# Altium schematic sheet 04_POWER_USB.SchDoc
size A3; DocumentNumber: 4; SheetNumber: 4; SheetTotal: 5; PageSetup: Record=PageOptions|CenterHorizontal=True|CenterVertical=True|PrintScale=1.00|XCorrection=1.00|YCorrection=1.00|PrintKind=1|BorderSize=5000000|LeftOffset=0|BottomOffset=0|Orientation=2|PaperLength=1000|PaperWidth=1000|Scale=100|PaperSource=7|PrintQuality=-4|MediaType=1|DitherType=10|PrintScaleMode=0|PaperKind=Letter|PaperIndex=1
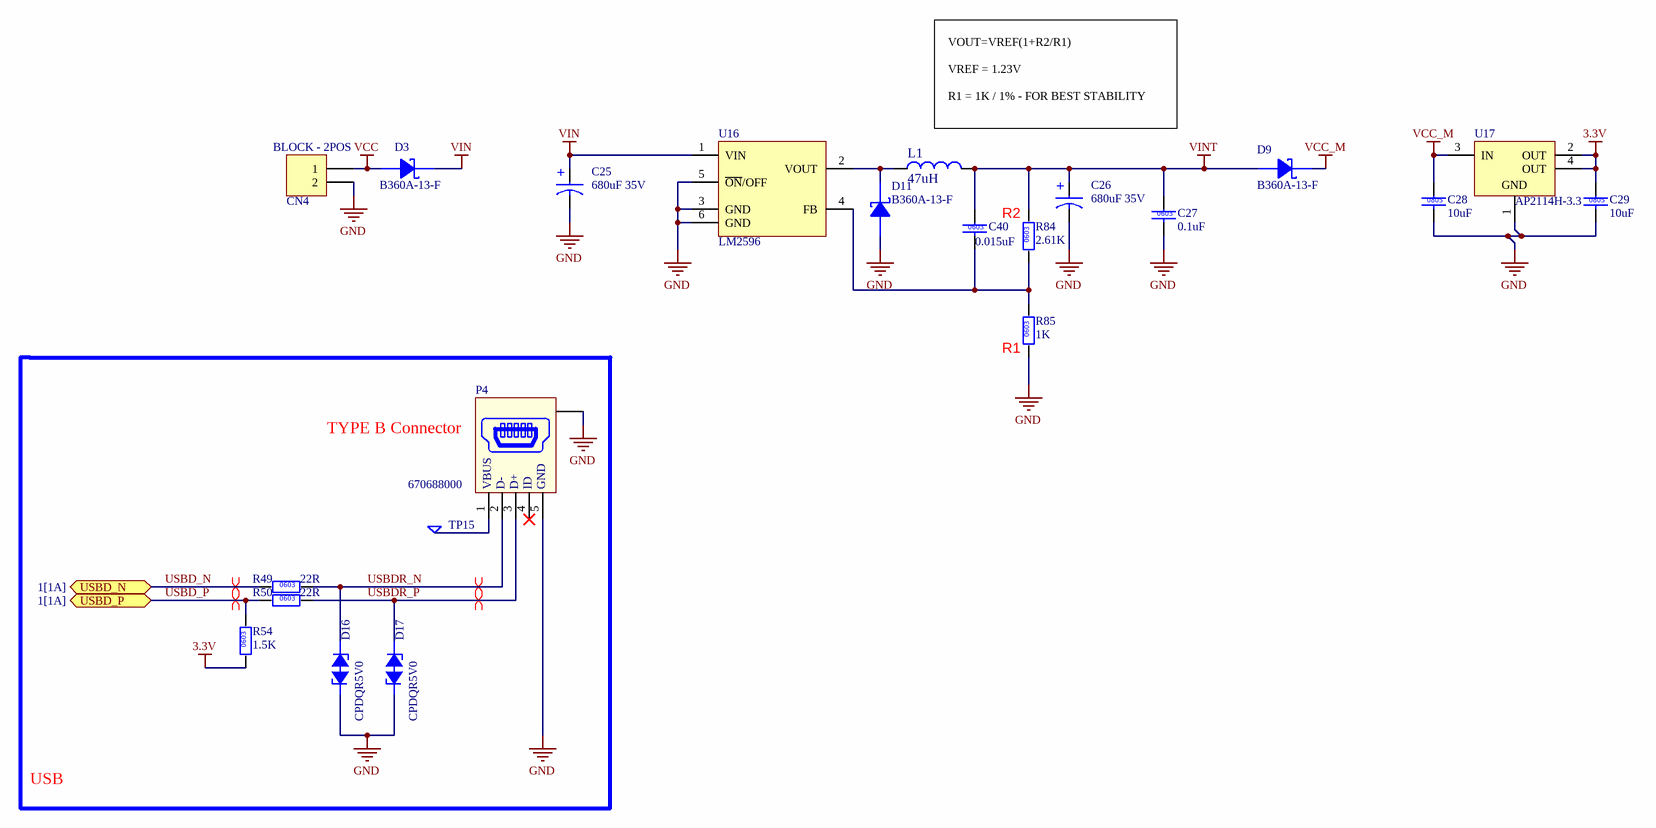
[diagram p0: 04_POWER_USB.SchDoc]

## Parts
?  (no value)  (graphical)
C25  680uF 35V  [CAP_RADIAL_10X28]
C26  680uF 35V  [CAP_RADIAL_10X28]
C27  0.1uF  [0603C]
C28  10uF  [0805C]
C29  10uF  [0805C]
C40  0.015uF  [0603C]
CN4  BLOCK - 2POS  [CONN_BORNE_3.81_2POS]
D3  B360A-13-F  [DO-214AC]
D9  B360A-13-F  [DO-214AC]
D11  B360A-13-F  [DO-214AC]
D16  CPDQR5V0  [0402ESD]
D17  CPDQR5V0  [0402ESD]
L1  47uH  [INDP1054]
P4  670688000  [USB_MICRO_0473460001]
R49  22R  [0603R]
R50  22R  [0603R]
R54  1.5K  [0603R]
R84  2.61K  [0603R]
R85  1K  [0603R]
TP15  TP  [TP]  (value not drawn)  (no BOM)
U16  LM2596  [DPAK5 - TO263]
U17  AP2114H-3.3  [SOT-223]

## Ports
USBD_N (bidir, see 1[1A]), USBD_P (bidir, see 1[1A])

## Nets
3.3V: C29.1 R54.1 U17.2(OUT) U17.4(OUT)
GND: C25.2 C26.2 C27.2 C28.2 C29.2 CN4.2 D11.2(A) D16.2(A) D17.2(A) P4.0(EARTH) P4.5(GND) R85.1 U16.3(GND) U16.5(~{ON}/OFF) U16.6(GND) U17.1(GND)
VCC: CN4.1 D3.2(A)
VCC_M: C28.1 D9.1(K) U17.3(IN)
VIN: C25.1 D3.1(K) U16.1(VIN)
VINT: C26.1 C27.1 C40.1 D9.2(A) L1.2 R84.2
USBD_N: R49.1 ; port USBD_N
USBD_P: R50.1 R54.2 ; port USBD_P
USBDR_N: D16.1(K) P4.2(D-) R49.2
USBDR_P: D17.1(K) P4.3(D+) R50.2
NetC40_2: C40.2 R84.1 R85.2 U16.4(FB)
NetD11_1: D11.1(K) L1.1 U16.2(VOUT)
NetP4_1: P4.1(VBUS) TP15.1

Not connected (* = marked no-connect by the designer): P4 4(ID)*

## Layout directives
differential pair: USBD_N, USBD_P, USBDR_N, USBDR_P

## Notes on the sheet
- (near L1) VOUT=VREF(1+R2/R1)
  VREF = 1.23V
  R1 = 1K / 1% - FOR BEST STABILITY
- (near R84) R2
- (near R85) R1
- (near P4) TYPE B Connector
- USB
- Project:
- Title:
- Rev.
- Size
- Sheet
- Date
- /
- R. Francisca Resende Merciai
  Nº 90
  Barão Geraldo
  13084-195 Campinas SP Brasil
- (in symbol PHI100.0.0603.01K5.001.1/10W) 0603
- (in symbol PHI100.0.0603.001K.001.1/10W) 0603
- (in symbol PHI100.0.0603.2K61.001.1/10W) 0603
- (in symbol PHI100.0.0603.022R.001.1/10W) 0603
- (in symbol PHI201.0.0603.000u1.005.050V.X7R) 0603
- (in symbol PHI201.0.0603.0u015.010.050V.X7R) 0603
- (in symbol PHI201.0.0805.0010u.010.010V.X5R) 0805
- (in symbol PHI202.0.000C.0680u.020.35V.XXX) +

## Library data of the parts
? = Title_Block3
C25 C26 = PHI202.0.000C.0680u.020.35V.XXX: CAP_AL_EL_13mm; Partnumber fabricante 1: NREHL681M35V10x28F; Fabricante 1: NIC Components Corp.; P Description: CAP ALUM 680UF 20% 35V RADIAL; Partnumber PHI: PHI202.0.000C.0680u.020.35V.XXX; Datasheet fabricante 1: http://pdf.datasheet.live/datasheets-1/nic_components/NREHL331M100V12.5X40F.pdf; Distribuidor 1: Digi Key; Distribuidor 2: Mouser; Value: 680uF 35V
C27 = PHI201.0.0603.000u1.005.050V.X7R: CAP0603; Partnumber fabricante 1: 06035C104JAT2A; Fabricante 1: AVX Corporation; P Description: Capacitor ceramico 0603 0.1uF 20% 50V X7R; SCH Info: GERAL; Partnumber PHI: PHI201.0.0603.000u1.005.050V.X7R; Datasheet fabricante 1: http://datasheets.avx.com/X7RDielectric.pdf; Distribuidor 1: Digi Key; PN distribuidor 1 / Fab 1: 478-5778-1-ND; Distribuidor 2: Mouser; Value: 0.1uF
C28 C29 = PHI201.0.0805.0010u.010.010V.X5R: CAP0805; Partnumber fabricante 1: 0805ZD106MAT2A; Fabricante 1: AVX Corporation; P Description: Capacitor ceramico 0805 10uF 10% 10V X5R; Partnumber PHI: PHI201.0.0805.0010u.010.010V.X5R; Datasheet fabricante 1: http://datasheets.avx.com/cx5r.pdf; Distribuidor 1: Digi Key; PN distribuidor 1 / Fab 1: 478-5326-1-ND; Distribuidor 2: Mouser; Value: 10uF
C40 = PHI201.0.0603.0u015.010.050V.X7R: CAP0603; Partnumber fabricante 1: CL10B153KB8SFNC; Fabricante 1: Samsung Electro-Mechanics America, Inc; P Description: Capacitor ceramico 0603 0.015uF 10% 50V X7R; SCH Info: GERAL; Partnumber PHI: PHI201.0.0603.0u015.010.050V.X7R; Datasheet fabricante 1: http://www.samsungsem.com/kr/support/product-search/mlcc/__icsFiles/afieldfile/2016/08/18/S_CL10B153KB8SFNC.pdf; Distribuidor 1: Digi Key; PN distribuidor 1 / Fab 1: 1276-1967-1-ND; Distribuidor 2: Mouser; Value: 0.015uF
CN4 = PHI740.1.M.OSTOQ023251: HEADER_2; Fabricante 1: On Shore Technology Inc.; P Description: TERM BLOCK HDR 2POS 90DEG 3.81MM; SCH Info: GERAL; Partnumber PHI: PHI740.1.M.OSTOQ023251; Partnumber fabricante 1: OSTOQ023251; Datasheet fabricante 1: http://www.on-shore.com/wp-content/uploads/2015/09/ostoqxx3251.pdf; Distribuidor 1: Digi Key; PN distribuidor 1 / Fab 1: ED2808-ND; Distribuidor 2: Mouser; Value: BLOCK - 2POS
D3 D9 D11 = PHI420.0.B360A-13-F: DIODE_SCHOTTKY_DO-214AB; Fabricante 1: Diodes Incorporated; P Description: DIODE SCHOTTKY 60V 3A SMA; SCH Info: GERAL; Partnumber PHI: PHI420.0.B360A-13-F; Partnumber fabricante 1: B360A-13-F; Datasheet fabricante 1: http://www.diodes.com/_files/datasheets/ds30891.pdf; Distribuidor 1: Digi Key; PN distribuidor 1 / Fab 1: B360A-FDICT-ND; Distribuidor 2: Mouser; Value: B360A-13-F
D16 D17 = PHI430.0.1.CPDQR5V0: Fabricante 1: Comchip Technology; P Description: TVS DIODE 5VWM 15VC 0402; Partnumber PHI: PHI430.0.1.CPDQR5V0; Partnumber fabricante 1: CPDQR5V0; Datasheet fabricante 1: http://www.comchiptech.com/cms/UserFiles/QW-A7013-CPDQR5V0-RevD633683.pdf; Distribuidor 1: Digi Key; PN distribuidor 1 / Fab 1: 641-1294-1-ND; Distribuidor 2: Mouser; Value: CPDQR5V0
L1 = PHI300.0.1908.0047u.020.04A2.109mOHM: IND_744042220; Partnumber fabricante 1: ETQ-P5M470YFC; Fabricante 1: Panasonic Eletronic Components; P Description: 47µH Shielded Wirewound Inductor 4.2A 108.9 mOhm Max 2-SMD, J-Lead; SCH Info: GERAL; Partnumber PHI: PHI300.0.1908.0047u.020.04A2.109mOHM; Datasheet fabricante 1: https://industrial.panasonic.com/cdbs/www-data/pdf/AGL0000/AGL0000C49.pdf; Distribuidor 1: Digi Key; PN distribuidor 1 / Fab 1: PCD2467CT-ND; Distribuidor 2: Mouser; Value: 47uH
P4 = PHI720.1.F.47346-0001: USB-B_MINI_V; Fabricante 1: Molex; P Description: CONN RCPT 5POS MICRO USB R/A; Value: USB-MICRO; Partnumber PHI: PHI720.1.F.47346-0001; Partnumber fabricante 1: 47346-0001; Datasheet fabricante 1: http://www.molex.com/pdm_docs/sd/473460001_sd.pdf; Distribuidor 1: Digi Key; PN distribuidor 1 / Fab 1: WM17141TR-ND; Distribuidor 2: Mouser
R49 R50 = PHI100.0.0603.022R.001.1/10W: RES0603; Partnumber fabricante 1: RC0603FR-0722RL; Fabricante 1: Yageo; Fabricante 2: Stackpole Electronics Inc; P Description: Resistor SMD 0603 22R 1% 1/10W; SCH Info: GERAL; Partnumber PHI: PHI100.0.0603.022R.001.1/10W; Datasheet fabricante 1: http://www.yageo.com/NewPortal/yageodocoutput?fileName=/pdf/R-Chip/PYu-RC_Group_51_RoHS_L_3.pdf; Partnumber fabricante 2: RMCF0603FT22R0; Datasheet fabricante 2: http://www.seielect.com/Catalog/SEI-RMCF_RMCP.pdf; Distribuidor 1: Digi Key; PN distribuidor 1 / Fab 1: 311-22.0HRCT-ND; PN distribuidor 1 / Fab 2: RMCF0603FT22R0CT-ND; Distribuidor 2: Mouser; Value: 22R
R54 = PHI100.0.0603.01K5.001.1/10W: RES0603; Partnumber fabricante 1: RC0603FR-071K5L; Fabricante 1: Yageo; Fabricante 2: Stackpole Electronics Inc; P Description: Resistor SMD 0603 1.5K 1% 1/10W; SCH Info: GERAL; Partnumber PHI: PHI100.0.0603.01K5.001.1/10W; Datasheet fabricante 1: http://www.yageo.com/NewPortal/yageodocoutput?fileName=/pdf/R-Chip/PYu-RC_Group_51_RoHS_L_3.pdf; Partnumber fabricante 2: RMCF0603FT1K50; Datasheet fabricante 2: http://www.seielect.com/Catalog/SEI-RMCF_RMCP.pdf; Distribuidor 1: Digi Key; PN distribuidor 1 / Fab 1: 311-1.50KHRCT-ND; PN distribuidor 1 / Fab 2: RMCF0603FT1K50CT-ND; Distribuidor 2: Mouser; Value: 1.5K
R84 = PHI100.0.0603.2K61.001.1/10W: RES0603; Partnumber fabricante 1: RC0603FR-072K61L; Fabricante 1: Yageo; P Description: Resistor SMD 0603 2.61K 1% 1/10W; SCH Info: GERAL; Partnumber PHI: PHI100.0.0603.2K61.001.1/10W; Datasheet fabricante 1: http://www.yageo.com.tw/exep/pages/download/literatures/PYu-R_INT-thick_7.pdf; Distribuidor 1: Digi Key; PN distribuidor 1 / Fab 1: 311-2.61KHRCT-ND; Distribuidor 2: Mouser; Value: 2.61K
R85 = PHI100.0.0603.001K.001.1/10W: RES0603; Partnumber fabricante 1: RC0603FR-071KL; Fabricante 1: Yageo; Fabricante 2: Panasonic Electronic Components; P Description: Resistor SMD 0603 1K 1% 1/10W; SCH Info: GERAL; Partnumber PHI: PHI100.0.0603.001K.001.1/10W; Datasheet fabricante 1: http://www.yageo.com/NewPortal/yageodocoutput?fileName=/pdf/R-Chip/PYu-RC_Group_51_RoHS_L_3.pdf; Partnumber fabricante 2: ERJ-3EKF1001V; Datasheet fabricante 2: http://industrial.panasonic.com/www-cgi/jvcr13pz.cgi?E+PZ+3+AOA0002+ERJ3EKF1001V+7+WW; Distribuidor 1: Digi Key; PN distribuidor 1 / Fab 1: 311-1.00KHRCT-ND; PN distribuidor 1 / Fab 2: P1.00KHCT-ND; Distribuidor 2: Mouser; Value: 1K
TP15 = TP: Test Point; PCB INFO: DNP; SCH Info: 2G/3G
U16 = PHI800.0.LM2596DSADJG: IC REG BUCK ADJ 3A TO263-5; Fabricante 1: ON Semiconductor; Fabricante 2: Texas Instruments; Value: LM2596ADJ; P Description: IC REG MULT CONFIG INV ADJ D2PAK; SCH Info: GERAL; Partnumber PHI: PHI800.0.LM2596DSADJG; Partnumber fabricante 1: LM2596DSADJG; Datasheet fabricante 1: http://www.onsemi.com/pub_link/Collateral/LM2596-D.PDF; Partnumber fabricante 2: LM2596SX-ADJ/NOPB; Datasheet fabricante 2: http://www.ti.com/lit/ds/symlink/lm2596.pdf; Distribuidor 1: Digi Key; PN distribuidor 1 / Fab 1: LM2596DSADJGOS-ND; PN distribuidor 1 / Fab 2: 296-35399-1-ND; Distribuidor 2: Mouser
U17 = PHI800.0.AP2114H-3.3TRG1: IC REG LDO 3.3V 1A SOT223; Fabricante 1: Diodes Incorporated; Partnumber PHI: PHI800.0.AP2114H-3.3TRG1; Partnumber fabricante 1: AP2114H-3.3TRG1; Datasheet fabricante 1: https://www.diodes.com/assets/Datasheets/AP2114.pdf; Distribuidor 1: Digi Key; PN distribuidor 1 / Fab 1: AP2114H-3.3TRG1DICT-ND; Distribuidor 2: Mouser; P Description: IC REG LDO 3.3V 1A SOT223; Value: AP2114H-3.3